# EAGLE design pogo-org (EAGLE 6.1)
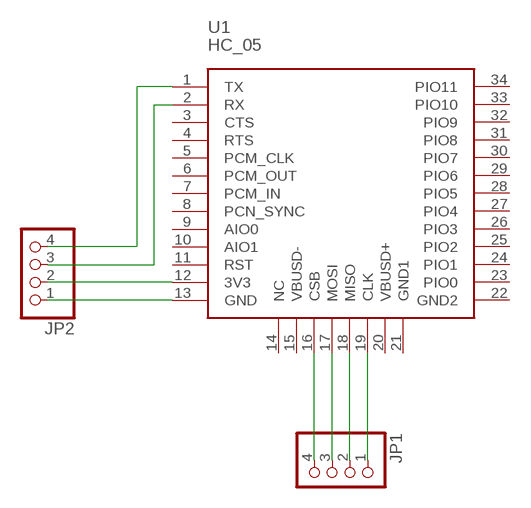
[diagram p0: schematic, sheet 1]

## Parts
JP1  PINHD-1X4  [1X04]
JP2  PINHD-1X4  [1X04]
U1  HC_05  [BLUETOOTH_SMD]

## Nets
N$1: JP1.1 U1.19(CLK)
N$2: JP1.2 U1.18(MISO)
N$3: JP1.3 U1.17(MOSI)
N$4: JP1.4 U1.16(CSB)
N$5: JP2.1 U1.13(GND)
N$6: JP2.2 U1.12(3V3)
N$7: JP2.3 U1.2(RX)
N$8: JP2.4 U1.1(TX)
Unconnected: U1.3(CTS) U1.4(RTS) U1.5(PCM_CLK) U1.6(PCM_OUT) U1.7(PCM_IN) U1.8(PCN_SYNC) U1.9(AIO0) U1.10(AIO1) U1.11(RST) U1.14(NC) U1.15(VBUSD-) U1.20(VBUSD+) U1.21(GND1) U1.22(GND2) U1.23(PIO0) U1.24(PIO1) U1.25(PIO2) U1.26(PIO3) U1.27(PIO4) U1.28(PIO5) U1.29(PIO6) U1.30(PIO7) U1.31(PIO8) U1.32(PIO9) U1.33(PIO10) U1.34(PIO11)

## Library data of the parts
JP1 JP2 = pinhead:PINHD-1X4: PIN HEADER
U1 = BluetoothHC-05:HC_05: HC-05 Bluetooth Module

## Board
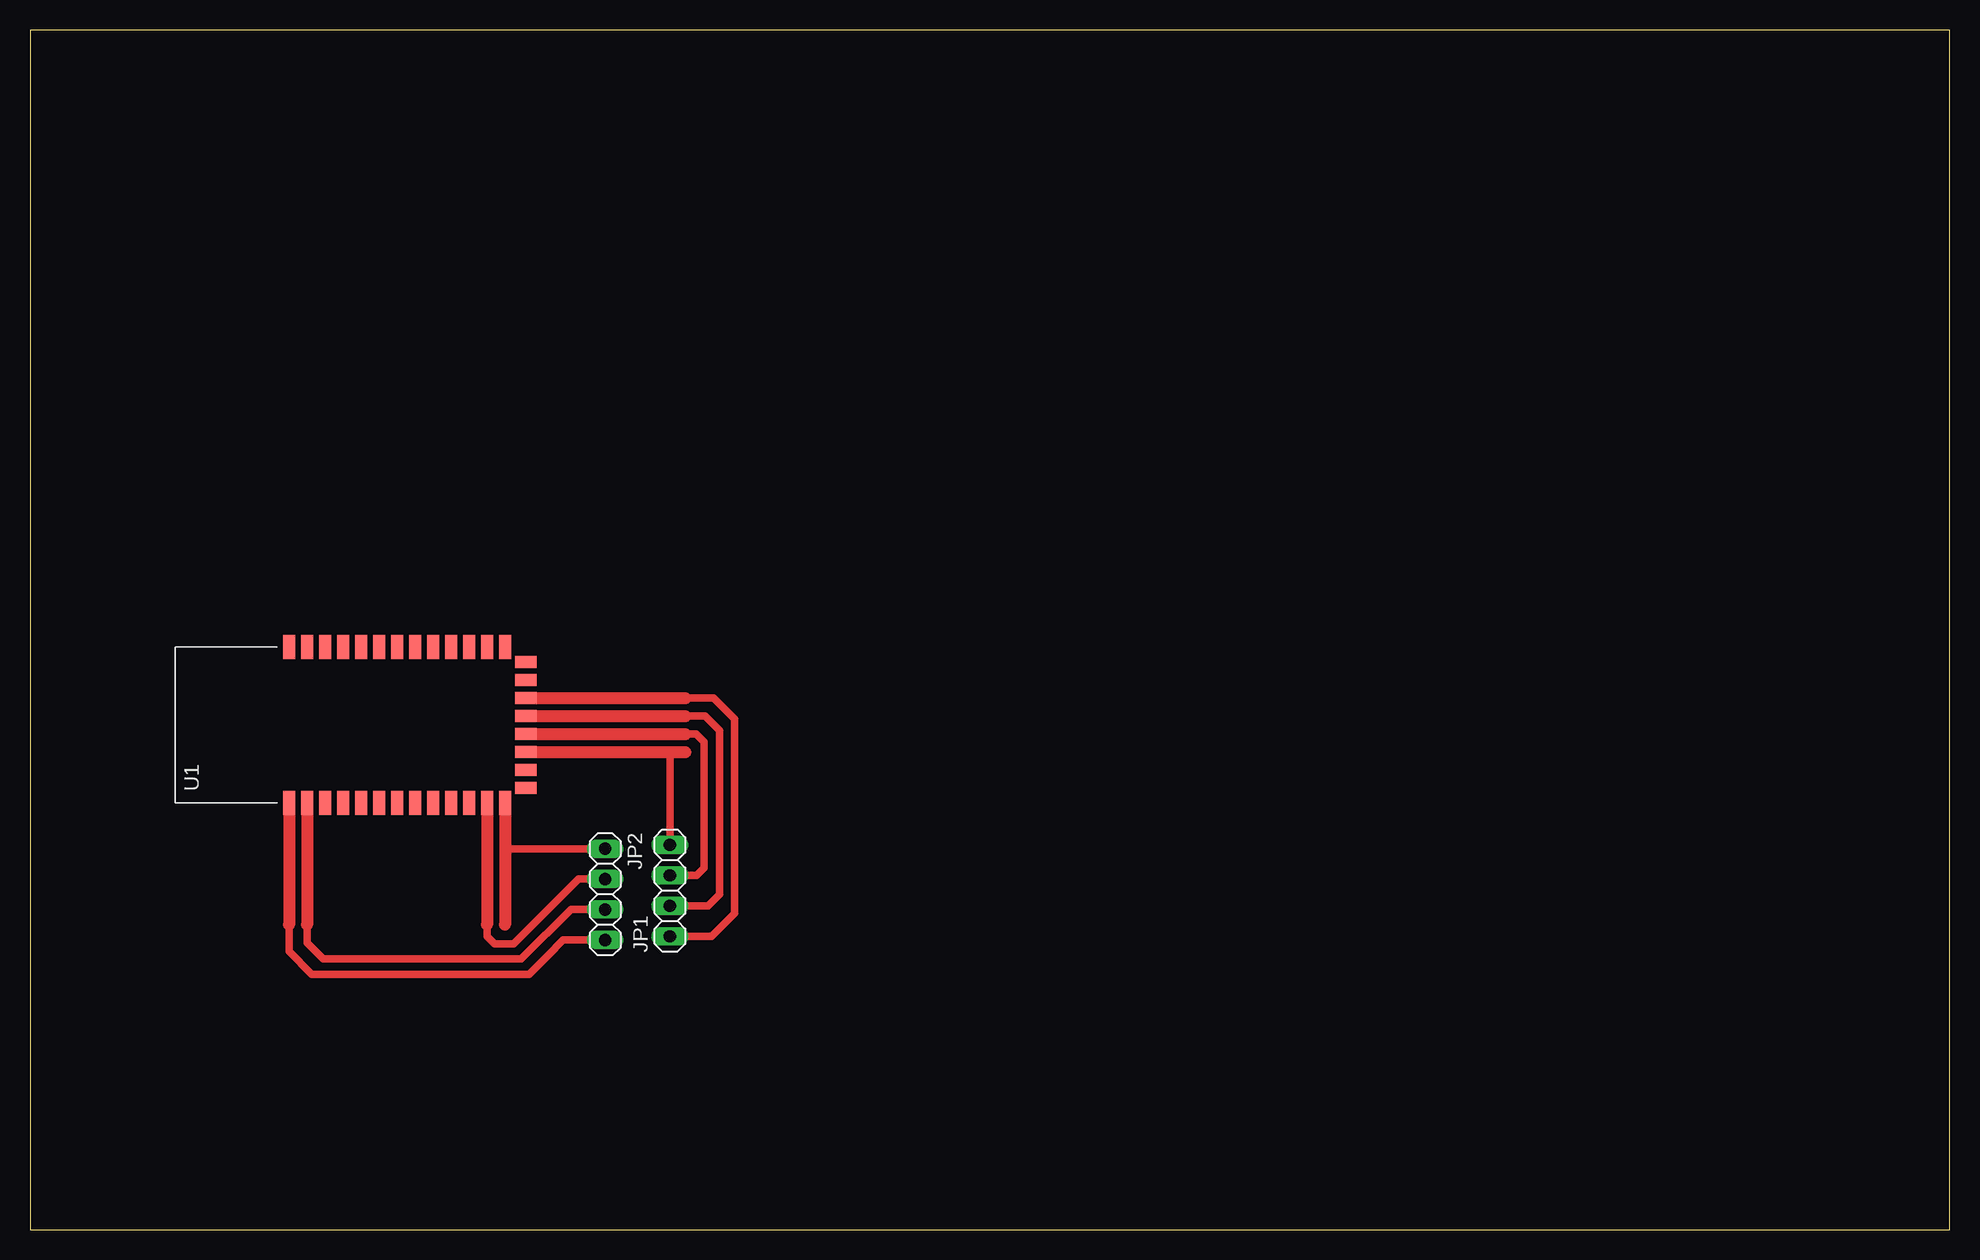
[diagram p1: board, top side]

Size 160 x 100 mm. Coordinates in mm from the lower left corner, seen from the top.
Outline: 0,0 160,0 160,100 0,100 0,0
Copper layers (1*16): Top 0.035mm / dielectric 1.5mm / Bottom 0.035mm
Design rules: minimum track width 10mil, minimum drill 24mil, track to track 12mil, track to pad 12mil, pad to pad 12mil, via to via 12mil, smd to smd 10mil, copper to edge 12mil, drill to drill 12mil, minimum pad ring 10mil, minimum via ring 10mil, stop-mask expansion 4mil, vias tented up to drill 0mil, thermal gap 12mil

### Footprints (pad centres in the part's own frame; a part is rotated, then mirrored left to right if it is on the bottom)
1X04 = drill 1.016 long: 1 -3.81,0; 2 -1.27,0; 3 1.27,0; 4 3.81,0
BLUETOOTH_SMD = smd 2 x 1: 1 -6.35,3.81; 2 -6.35,2.31; 3 -6.35,0.81; 4 -6.35,-0.69; 5 -6.35,-2.19; 6 -6.35,-3.69; 7 -6.35,-5.19; 8 -6.35,-6.69; 9 -6.35,-8.19; 10 -6.35,-9.69; 11 -6.35,-11.19; 12 -6.35,-12.69; 13 -6.35,-14.19; 22 6.65,-14.19; 23 6.65,-12.69; 24 6.65,-11.19; 25 6.65,-9.69; 26 6.65,-8.19; 27 6.65,-6.69; 28 6.65,-5.19; 29 6.65,-3.69; 30 6.65,-2.19; 31 6.65,-0.69; 32 6.65,0.81; 33 6.65,2.31; 34 6.65,3.81 | smd 1 x 1.8: 14 -5.1,-15.94; 15 -3.6,-15.94; 16 -2.1,-15.94; 17 -0.6,-15.94; 18 0.9,-15.94; 19 2.4,-15.94; 20 3.9,-15.94; 21 5.4,-15.94

### Placement (x,y rotation side)
JP1  53.34,28.26 90 top
JP2  47.94,27.94 270 top
U1  25.4,41.91 90 top

### Tracks (layer width: path | path; a pad name or v marks a point on that pad's centre or on a via)
N$1
  Top 0.61: JP1.1 56.83,24.45 58.74,26.35 58.74,42.55 56.97,44.31 54.61,44.31
  Top 1.016: U1.19 54.61,44.31
N$2
  Top 0.61: 54.61,42.81 56.25,42.81 57.47,41.59 57.47,27.94 56.52,26.99 JP1.2
  Top 1.016: U1.18 54.61,42.81
N$3
  Top 0.61: 54.61,41.31 55.53,41.31 56.2,40.64 56.2,30.16 55.56,29.53 JP1.3
  Top 1.016: U1.17 54.61,41.31
N$4
  Top 0.61: JP1.4 53.34,39.81
  Top 1.016: U1.16 53.34,39.81 54.61,39.81
N$5
  Top 0.61: JP2.1 40.01,31.75 39.85,31.59 | 39.85,31.59 39.69,31.43 | 39.59,34.83 39.59,31.85 39.85,31.59
  Top 1.016: U1.13 39.59,34.83 39.59,25.4
N$6
  Top 0.61: 38.09,25.4 38.09,24.46 38.73,23.81 40.32,23.81 45.72,29.21 JP2.2
  Top 1.016: U1.12 38.09,25.4
N$7
  Top 0.61: 23.09,25.4 23.09,23.9 24.45,22.54 40.96,22.54 45.09,26.67 JP2.3
  Top 1.016: U1.2 23.09,25.4
N$8
  Top 0.61: 21.59,25.4 21.59,23.18 23.5,21.27 41.59,21.27 43.18,22.86 44.45,24.13 JP2.4
  Top 1.016: U1.1 21.59,25.4